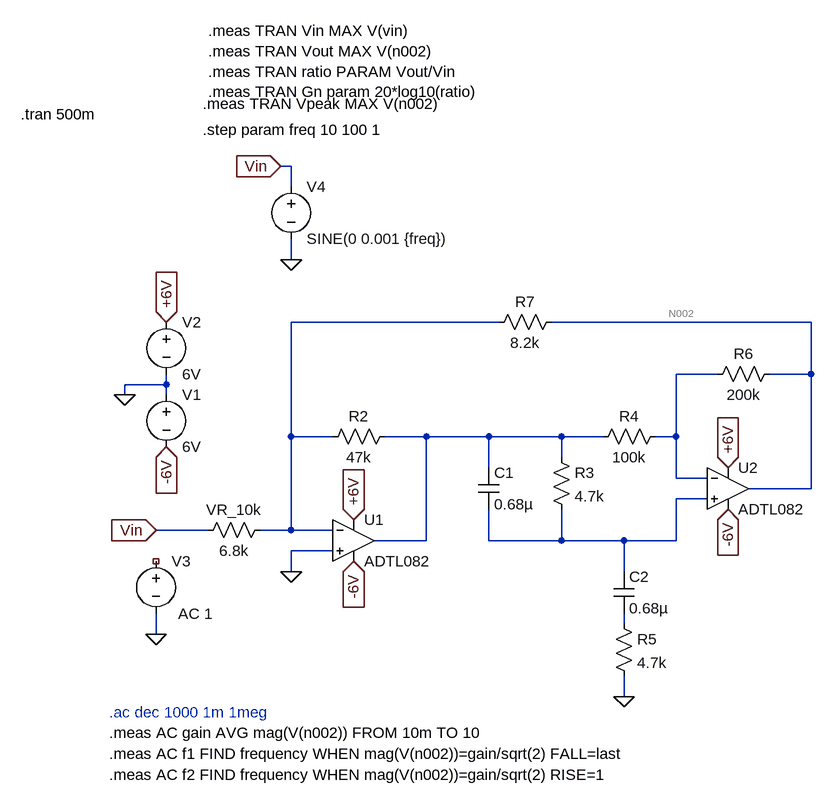
[diagram p0: schematic Filter Testing.asc]
Filter Testing.asc, the LTspice schematic file:
Version 4.1
SHEET 1 924 680
WIRE -32 -560 -48 -560
WIRE -32 -528 -32 -560
WIRE -32 -416 -32 -448
WIRE 288 -320 -32 -320
WIRE 768 -320 368 -320
WIRE 624 -240 560 -240
WIRE 768 -240 768 -320
WIRE 768 -240 704 -240
WIRE -224 -224 -224 -240
WIRE -224 -224 -288 -224
WIRE -288 -208 -288 -224
WIRE -224 -208 -224 -224
WIRE -32 -144 -32 -320
WIRE 32 -144 -32 -144
WIRE 176 -144 112 -144
WIRE 272 -144 176 -144
WIRE 384 -144 272 -144
WIRE 448 -144 384 -144
WIRE 560 -144 560 -240
WIRE 560 -144 528 -144
WIRE 384 -112 384 -144
WIRE 272 -96 272 -144
WIRE 560 -80 560 -144
WIRE 608 -80 560 -80
WIRE 768 -64 768 -240
WIRE 768 -64 672 -64
WIRE 608 -48 560 -48
WIRE -160 0 -240 0
WIRE -32 0 -32 -144
WIRE -32 0 -80 0
WIRE 32 0 -32 0
WIRE 176 16 176 -144
WIRE 176 16 96 16
WIRE 272 16 272 -32
WIRE 384 16 384 -32
WIRE 384 16 272 16
WIRE 480 16 384 16
WIRE 560 16 560 -48
WIRE 560 16 480 16
WIRE 32 32 -32 32
WIRE -32 64 -32 32
WIRE 480 64 480 16
WIRE 480 144 480 128
WIRE -240 160 -240 128
WIRE 480 256 480 224
FLAG -288 -208 0
FLAG -224 -320 +6V
IOPIN -224 -320 In
FLAG 64 -16 +6V
IOPIN 64 -16 In
FLAG 640 -96 +6V
IOPIN 640 -96 In
FLAG -224 -128 -6V
IOPIN -224 -128 In
FLAG 64 48 -6V
IOPIN 64 48 In
FLAG 640 -32 -6V
IOPIN 640 -32 In
FLAG -240 160 0
FLAG -32 64 0
FLAG 480 256 0
FLAG -32 -416 0
FLAG -48 -560 Vin
IOPIN -48 -560 In
FLAG -240 0 Vin
IOPIN -240 0 In
SYMBOL OpAmps\\ADTL082 64 -48 R0
SYMATTR InstName U1
SYMBOL OpAmps\\ADTL082 640 -128 R0
SYMATTR InstName U2
SYMBOL voltage -224 -224 R0
WINDOW 123 0 0 Left 0
WINDOW 39 0 0 Left 0
SYMATTR InstName V1
SYMATTR Value 6V
SYMBOL voltage -224 -336 R0
WINDOW 123 0 0 Left 0
WINDOW 39 0 0 Left 0
SYMATTR InstName V2
SYMATTR Value 6V
SYMBOL voltage -240 32 R0
WINDOW 3 24 152 Left 2
WINDOW 123 34 97 Left 2
WINDOW 39 0 0 Left 0
SYMATTR Value ""
SYMATTR Value2 AC 1
SYMATTR InstName V3
SYMBOL res -64 -16 R90
WINDOW 0 0 56 VBottom 2
WINDOW 3 32 56 VTop 2
SYMATTR InstName VR_10k
SYMATTR Value 6.8k
SYMATTR SpiceLine tol=5 pwr=0.25
SYMBOL res 128 -160 R90
WINDOW 0 0 56 VBottom 2
WINDOW 3 32 56 VTop 2
SYMATTR InstName R2
SYMATTR Value 47k
SYMATTR SpiceLine tol=5 pwr=0.25
SYMBOL cap 256 -96 R0
SYMATTR InstName C1
SYMATTR Value 0.68µ
SYMATTR SpiceLine V=50
SYMBOL res 368 -128 R0
SYMATTR InstName R3
SYMATTR Value 4.7k
SYMATTR SpiceLine tol=5 pwr=0.25
SYMBOL res 544 -160 R90
WINDOW 0 0 56 VBottom 2
WINDOW 3 32 56 VTop 2
SYMATTR InstName R4
SYMATTR Value 100k
SYMATTR SpiceLine tol=5 pwr=0.25
SYMBOL cap 464 64 R0
SYMATTR InstName C2
SYMATTR Value 0.68µ
SYMATTR SpiceLine V=50
SYMBOL res 464 128 R0
SYMATTR InstName R5
SYMATTR Value 4.7k
SYMATTR SpiceLine tol=5 pwr=0.25
SYMBOL res 720 -256 R90
WINDOW 0 0 56 VBottom 2
WINDOW 3 32 56 VTop 2
SYMATTR InstName R6
SYMATTR Value 200k
SYMATTR SpiceLine tol=5 pwr=0.25
SYMBOL res 384 -336 R90
WINDOW 0 0 56 VBottom 2
WINDOW 3 32 56 VTop 2
SYMATTR InstName R7
SYMATTR Value 8.2k
SYMATTR SpiceLine tol=5 pwr=0.25
SYMBOL voltage -32 -544 R0
WINDOW 123 0 0 Left 0
WINDOW 39 0 0 Left 0
SYMATTR InstName V4
SYMATTR Value SINE(0 0.001 {freq})
TEXT -312 280 Left 2 ;.ac dec 1000 1m 1meg
TEXT -312 312 Left 2 !.meas AC gain AVG mag(V(n002)) FROM 10m TO 10
TEXT -312 344 Left 2 !.meas AC f1 FIND frequency WHEN mag(V(n002))=gain/sqrt(2) FALL=last
TEXT -312 376 Left 2 !.meas AC f2 FIND frequency WHEN mag(V(n002))=gain/sqrt(2) RISE=1
TEXT -448 -640 Left 2 !.tran 500m
TEXT -168 -616 Left 2 !.step param freq 10 100 1
TEXT -168 -656 Left 2 !.meas TRAN Vpeak MAX V(n002)
TEXT -160 -768 Left 2 !.meas TRAN Vin MAX V(vin)\n.meas TRAN Vout MAX V(n002)\n.meas TRAN ratio PARAM Vout/Vin\n.meas TRAN Gn param 20*log10(ratio)

The netlist it stands for:
* Filter Testing.asc
X§U1 0 N001 +6V -6V N004 ADTL082  ; pins In+ In- V+ V- OUT
X§U2 N005 N003 +6V -6V N002 ADTL082  ; pins In+ In- V+ V- OUT
V1 0 -6V 6V
V2 +6V 0 6V
V3 NC_01 0 AC 1
R§VR_10k N001 Vin 6.8k tol=5 pwr=0.25
R2 N004 N001 47k tol=5 pwr=0.25
C1 N004 N005 0.68µ V=50
R3 N004 N005 4.7k tol=5 pwr=0.25
R4 N003 N004 100k tol=5 pwr=0.25
C2 N005 N006 0.68µ V=50
R5 N006 0 4.7k tol=5 pwr=0.25
R6 N002 N003 200k tol=5 pwr=0.25
R7 N002 N001 8.2k tol=5 pwr=0.25
V4 Vin 0 SINE(0 0.001 {freq})
* .ac dec 1000 1m 1meg
.meas AC gain AVG mag(V(n002)) FROM 10m TO 10
.meas AC f1 FIND frequency WHEN mag(V(n002))=gain/sqrt(2) FALL=last
.meas AC f2 FIND frequency WHEN mag(V(n002))=gain/sqrt(2) RISE=1
.tran 500m
.step param freq 10 100 1
.meas TRAN Vpeak MAX V(n002)
.meas TRAN Vin MAX V(vin)
.meas TRAN Vout MAX V(n002)
.meas TRAN ratio PARAM Vout/Vin
.meas TRAN Gn param 20*log10(ratio)
.lib ADI.lib
.backanno
.end